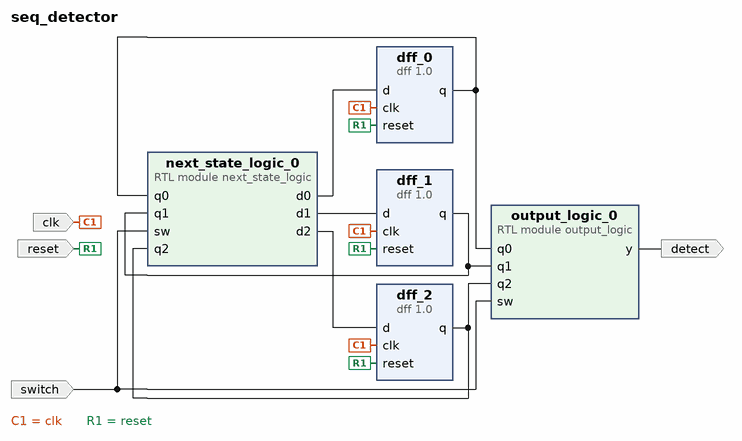
[diagram p0: block diagram of the top level]
# Vivado block design seq_detector, xc7a35tcpg236-1, Vivado 2018.2
create_bd_design seq_detector

create_bd_port -dir I -type ce clk
create_bd_port -dir I -type rst reset
set_property -dict {CONFIG.POLARITY ACTIVE_HIGH} [get_bd_ports reset]
create_bd_port -dir I switch
create_bd_port -dir O detect

create_bd_cell -type ip -vlnv FIT:user:dff:1.0 dff_0
create_bd_cell -type ip -vlnv FIT:user:dff:1.0 dff_1
create_bd_cell -type ip -vlnv FIT:user:dff:1.0 dff_2
create_bd_cell -type module -reference next_state_logic next_state_logic_0
create_bd_cell -type module -reference output_logic output_logic_0

# ---- connections ----

connect_bd_net [get_bd_pins dff_0/q] [get_bd_pins next_state_logic_0/q0] [get_bd_pins output_logic_0/q0]
connect_bd_net [get_bd_pins dff_1/q] [get_bd_pins next_state_logic_0/q1] [get_bd_pins output_logic_0/q1]
connect_bd_net [get_bd_pins dff_2/q] [get_bd_pins next_state_logic_0/q2] [get_bd_pins output_logic_0/q2]
connect_bd_net [get_bd_ports clk] [get_bd_pins dff_1/clk] [get_bd_pins dff_0/clk] [get_bd_pins dff_2/clk]
connect_bd_net [get_bd_ports reset] [get_bd_pins dff_2/reset] [get_bd_pins dff_1/reset] [get_bd_pins dff_0/reset]
connect_bd_net [get_bd_ports switch] [get_bd_pins next_state_logic_0/sw] [get_bd_pins output_logic_0/sw]
connect_bd_net [get_bd_pins next_state_logic_0/d0] [get_bd_pins dff_0/d]
connect_bd_net [get_bd_pins next_state_logic_0/d1] [get_bd_pins dff_1/d]
connect_bd_net [get_bd_pins next_state_logic_0/d2] [get_bd_pins dff_2/d]
connect_bd_net [get_bd_pins output_logic_0/y] [get_bd_ports detect]

validate_bd_design
save_bd_design
